# EAGLE design Nodino-Core2538 (EAGLE 6.5.0)
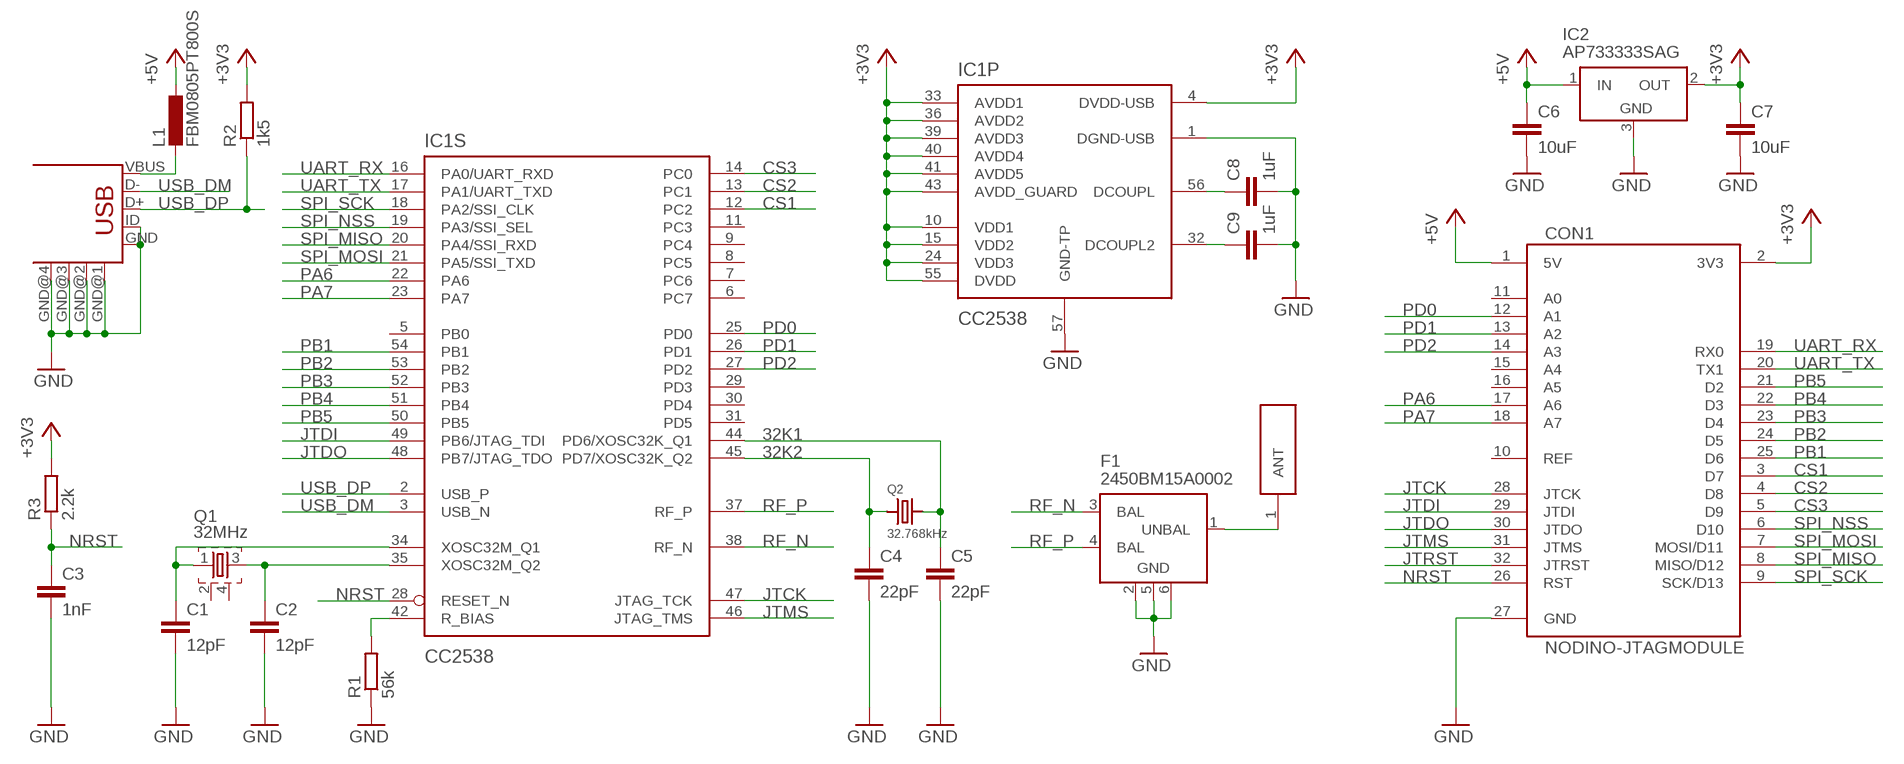
[diagram p0: schematic, sheet 1]

## Parts
ANT1  2450AT18B100  [2450AT18B100]
C1  12pF  C-EUC0603K  [C0603K]
C2  12pF  C-EUC0603K  [C0603K]
C3  1nF  C-EUC0603K  [C0603K]
C4  22pF  C-EUC0603K  [C0603K]
C5  22pF  C-EUC0603K  [C0603K]
C6  10uF  C-EUC0603K  [C0603K]
C7  10uF  C-EUC0603K  [C0603K]
C8  1uF  C-EUC0603K  [C0603K]
C9  1uF  C-EUC0603K  [C0603K]
CON1  NODINO-JTAGMODULE  [NODINO-JTAG-MOD]
CON2  USB-OTG_SHIELD  [USB-UAB-S1]
F1  2450BM15A0002  [2450BM15A0002]
IC1  CC2538  [QFN56P800X800X100-57N]
IC2  AP733333SAG  [SOT23]
L1  FBM0805PT800S  L-EUL0805  [L0805]
Q1  32MHz  FA-20H  [FA-20H]
Q2  32.768kHz  CRYSTAL.ABS07  [ABS07]
R1  56k  R-EU_R0603K  [R0603K]
R2  1k5  R-EU_R0603K  [R0603K]
R3  2.2k  R-EU_R0603K  [R0603K]

## Nets
32K1: C5.1 IC1.44(S:PD6/XOSC32K_Q1) Q2.2
32K2: C4.1 IC1.45(S:PD7/XOSC32K_Q2) Q2.1
+3V3: C7.1 CON1.2(3V3) IC1.4(P:DVDD-USB) IC1.10(P:VDD1) IC1.15(P:VDD2) IC1.24(P:VDD3) IC1.33(P:AVDD1) IC1.36(P:AVDD2) IC1.39(P:AVDD3) IC1.40(P:AVDD4) IC1.41(P:AVDD5) IC1.43(P:AVDD_GUARD) IC1.55(P:DVDD) IC2.2(OUT) R2.2 R3.2
+5V: C6.1 CON1.1(5V) IC2.1(IN) L1.1
CS1: CON1.3(D7) IC1.12(S:PC2)
CS2: CON1.4(D8) IC1.13(S:PC1)
CS3: CON1.5(D9) IC1.14(S:PC0)
GND: C1.2 C2.2 C3.2 C4.2 C5.2 C6.2 C7.2 C8.2 C9.2 CON1.27(GND) CON2.GND CON2.GND@1(GND) CON2.GND@2(GND) CON2.GND@3(GND) CON2.GND@4(GND) CON2.ID F1.2(GND) F1.5(GND) F1.6(GND) IC1.1(P:DGND-USB) IC1.57(P:GND-TP) IC2.3(GND) R1.1
JTCK: CON1.28(JTCK) IC1.47(S:JTAG_TCK)
JTDI: CON1.29(JTDI) IC1.49(S:PB6/JTAG_TDI)
JTDO: CON1.30(JTDO) IC1.48(S:PB7/JTAG_TDO)
JTMS: CON1.31(JTMS) IC1.46(S:JTAG_TMS)
JTRST: CON1.32(JTRST)
N$1: CON2.VBUS L1.2
N$2: ANT1.1(ANT) F1.1(UNBAL)
N$3: C8.1 IC1.56(P:DCOUPL)
N$4: C9.1 IC1.32(P:DCOUPL2)
N$5: IC1.42(S:R_BIAS) R1.2
N$7: C2.1 IC1.35(S:XOSC32M_Q2) Q1.3
N$8: C1.1 IC1.34(S:XOSC32M_Q1) Q1.1
NRST: C3.1 CON1.26(RST) IC1.28(S:RESET_N) R3.1
PA6: CON1.17(A6) IC1.22(S:PA6)
PA7: CON1.18(A7) IC1.23(S:PA7)
PB1: CON1.25(D6) IC1.54(S:PB1)
PB2: CON1.24(D5) IC1.53(S:PB2)
PB3: CON1.23(D4) IC1.52(S:PB3)
PB4: CON1.22(D3) IC1.51(S:PB4)
PB5: CON1.21(D2) IC1.50(S:PB5)
PD0: CON1.12(A1) IC1.25(S:PD0)
PD1: CON1.13(A2) IC1.26(S:PD1)
PD2: CON1.14(A3) IC1.27(S:PD2)
RF_N: F1.3(BAL) IC1.38(S:RF_N)
RF_P: F1.4(BAL) IC1.37(S:RF_P)
SPI_MISO: CON1.8(MISO/D12) IC1.20(S:PA4/SSI_RXD)
SPI_MOSI: CON1.7(MOSI/D11) IC1.21(S:PA5/SSI_TXD)
SPI_NSS: CON1.6(D10) IC1.19(S:PA3/SSI_SEL)
SPI_SCK: CON1.9(SCK/D13) IC1.18(S:PA2/SSI_CLK)
UART_RX: CON1.19(RX0) IC1.16(S:PA0/UART_RXD)
UART_TX: CON1.20(TX1) IC1.17(S:PA1/UART_TXD)
USB_DM: CON2.D- IC1.3(S:USB_N)
USB_DP: CON2.D+ IC1.2(S:USB_P) R2.1
Unconnected: CON1.10(REF) CON1.11(A0) CON1.15(A4) CON1.16(A5) IC1.5(S:PB0) IC1.6(S:PC7) IC1.7(S:PC6) IC1.8(S:PC5) IC1.9(S:PC4) IC1.11(S:PC3) IC1.29(S:PD3) IC1.30(S:PD4) IC1.31(S:PD5) Q1.2 Q1.4

## Library data of the parts
ANT1 = johanson-technology:2450AT18B100
C1-C9 = resistor:C-EU: CAPACITOR, European symbol
CON1 = nodino:NODINO-JTAG
CON2 = con-usb-2:USB-OTG_SHIELD
F1 = johanson-technology:2450BM15A0002: 2.45 GHz Impedance Matched Balun-Filter For TI CC253X/CC2540 Chipset family Data sheet <http://www.johansontechnology.com/images/stories/ip/baluns/balun_filter_combo_matched_2450bm15a0002_v8.pdf>
IC1 = chipcon-ti-v2:CC2538: An ARM Cortex-M3 with 802.15.4 radio
IC2 = diodes_inc:AP7333
L1 = resistor:L-EU: INDUCTOR, European symbol
Q1 = crystal:FA-: MHz RANGE CRYSTAL UNIT Source: Epson Toyocom
Q2 = abracon:CRYSTAL
R1-R3 = resistor:R-EU_: RESISTOR, European symbol

## Board
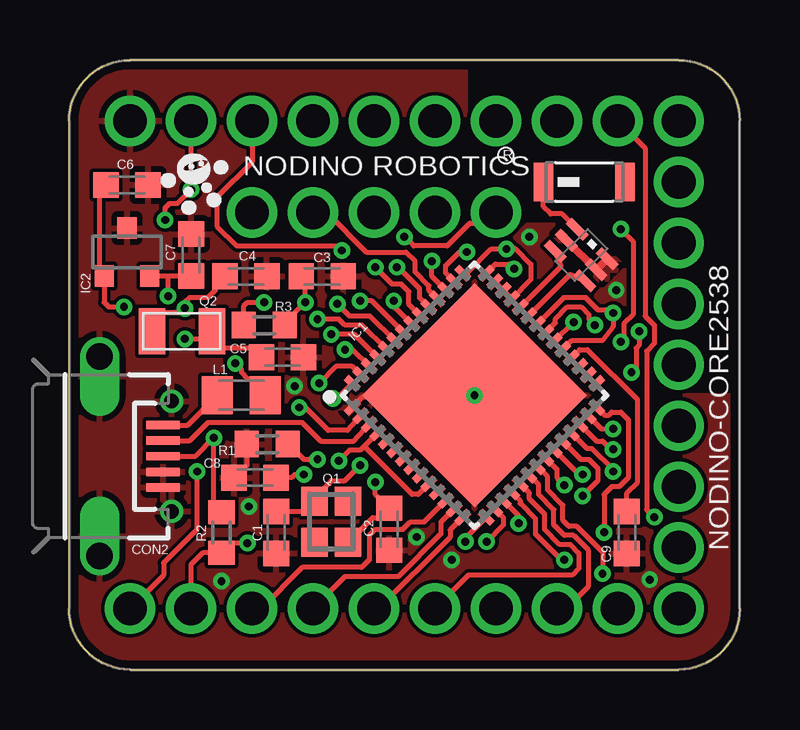
[diagram p1: board, top side]
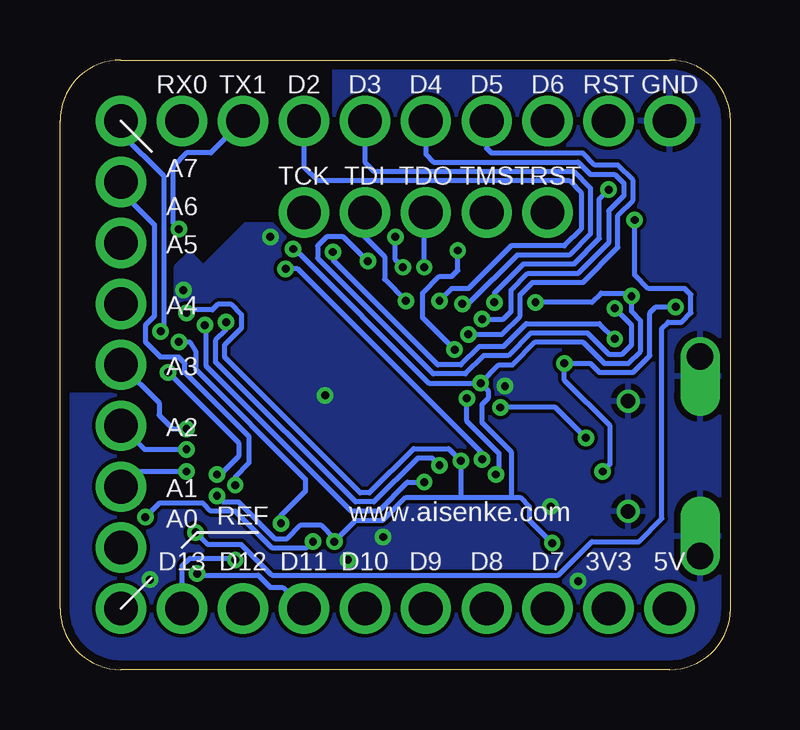
[diagram p2: board, bottom side, seen from below]

Size 27.94 x 25.4 mm. Coordinates in mm from the lower left corner, seen from the top.
Outline: 0,2.54 0,22.86 arc-90 2.54,25.4 25.4,25.4 arc-90 27.94,22.86 27.94,2.54 arc-90 25.4,0 2.54,0 arc-90 0,2.54
Copper layers (1*16): Top 0.0356mm / dielectric 1.5011mm / Bottom 0.0356mm
Design rules "LaenPCBOrder": minimum track width 6mil, minimum drill 13mil, track to track 6mil, track to pad 6mil, pad to pad 6mil, via to via 6mil, smd to smd 6mil, copper to edge 15mil, drill to drill 6mil, minimum pad ring 7mil, minimum via ring 7mil, stop-mask expansion 3mil, vias tented up to drill 0mil, thermal gap 10mil

### Footprints (pad centres in the part's own frame; a part is rotated, then mirrored left to right if it is on the bottom)
2450AT18B100 = smd 0.8 x 1.6: 1 -1.7,0; 2 1.7,0
C0603K = smd 1.05 x 1.08: 1 -0.875,0; 2 0.875,0
NODINO-JTAG-MOD = drill 1.4 pad 2.1: 1 -11.43,-10.16; 2 -8.89,-10.16; 3 -6.35,-10.16; 4 -3.81,-10.16; 5 -1.27,-10.16; 6 1.27,-10.16; 7 3.81,-10.16; 8 6.35,-10.16; 9 8.89,-10.16; 10 11.43,-10.16; 11 11.43,-7.62; 12 11.43,-5.08; 13 11.43,-2.54; 14 11.43,0; 15 11.43,2.54; 16 11.43,5.08; 17 11.43,7.62; 18 11.43,10.16; 19 8.89,10.16; 20 6.35,10.16; 21 3.81,10.16; 22 1.27,10.16; 23 -1.27,10.16; 24 -3.81,10.16; 25 -6.35,10.16; 26 -8.89,10.16; 27 -11.43,10.16; 28 3.81,6.35; 29 1.27,6.35; 30 -1.27,6.35; 31 -3.81,6.35; 32 -6.35,6.35
USB-UAB-S1 = smd 0.35 x 1.4: D+ 0,2.65; D- -0.65,2.65; GND 1.3,2.65; ID 0.65,2.65; VBUS -1.3,2.65 | drill 0.6: GND@1 -2.3,3; GND@2 2.3,3 | drill 1.1 offset: GND@3 -4.15,0; GND@4 4.15,0
2450BM15A0002 = smd 0.35 x 1: 1 -0.65,-0.875; 2 0,-0.875; 3 0.65,-0.875; 4 0.65,0.875; 5 0,0.875; 6 -0.65,0.875
QFN56P800X800X100-57N = smd 0.7 x 0.3: 1 -3.95,3.25; 2 -3.95,2.75; 3 -3.95,2.25; 4 -3.95,1.75; 5 -3.95,1.25; 6 -3.95,0.75; 7 -3.95,0.25; 8 -3.95,-0.25; 9 -3.95,-0.75; 10 -3.95,-1.25; 11 -3.95,-1.75; 12 -3.95,-2.25; 13 -3.95,-2.75; 14 -3.95,-3.25; 29 3.95,-3.25; 30 3.95,-2.75; 31 3.95,-2.25; 32 3.95,-1.75; 33 3.95,-1.25; 34 3.95,-0.75; 35 3.95,-0.25; 36 3.95,0.25; 37 3.95,0.75; 38 3.95,1.25; 39 3.95,1.75; 40 3.95,2.25; 41 3.95,2.75; 42 3.95,3.25 | smd 0.3 x 0.7: 15 -3.25,-3.95; 16 -2.75,-3.95; 17 -2.25,-3.95; 18 -1.75,-3.95; 19 -1.25,-3.95; 20 -0.75,-3.95; 21 -0.25,-3.95; 22 0.25,-3.95; 23 0.75,-3.95; 24 1.25,-3.95; 25 1.75,-3.95; 26 2.25,-3.95; 27 2.75,-3.95; 28 3.25,-3.95; 43 3.25,3.95; 44 2.75,3.95; 45 2.25,3.95; 46 1.75,3.95; 47 1.25,3.95; 48 0.75,3.95; 49 0.25,3.95; 50 -0.25,3.95; 51 -0.75,3.95; 52 -1.25,3.95; 53 -1.75,3.95; 54 -2.25,3.95; 55 -2.75,3.95; 56 -3.25,3.95 | smd 6.6 x 6.6: 57 0,0
SOT23 = smd 0.8 x 0.9: 1 -0.95,-1; 2 0.95,-1; 3 0,1
L0805 = smd 1.3 x 1.6: 1 -1,0; 2 1,0
FA-20H = smd 1.2 x 1.1: 1 -0.85,-0.7; 2 0.85,-0.7; 3 0.85,0.7; 4 -0.85,0.7
ABS07 = smd 1.1 x 1.9: 1 -1.25,0; 2 1.25,0
R0603K = smd 1 x 1.1: 1 -0.85,0; 2 0.85,0

### Placement (x,y rotation side)
ANT1  21.46,20.32 0 top
C1  8.64,5.71 270 top
C2  13.34,5.84 270 top
C3  10.54,16.38 0 top
C4  7.37,16.38 0 top
C5  8.89,13.02 0 top
C6  2.41,20.19 0 top
C7  5.08,17.27 90 top
C8  7.75,8 180 top
C9  23.24,5.71 270 top
CON1  13.97,12.7 0 top
CON2  1.27,8.89 270 top
F1  21.34,17.27 225 top
IC1  16.89,11.43 45 top
IC2  2.41,17.4 0 top
L1  7.18,11.43 180 top
Q1  10.92,6.16 270 top
Q2  4.7,14.1 0 top
R1  8.26,9.4 0 top
R2  6.35,5.71 270 top
R3  8.13,14.35 180 top

### Tracks (layer width: path | path; a pad name or v marks a point on that pad's centre or on a via)
32K1  (via drill 0.33)
  Top 0.203: 6.33,13.86 Q2.2 | 6.08,13.97 Q2.2 | v4.83,13.78 5.63,13.78 Q2.2 | C5.1 7.63,13.4 6.22,13.4 5.95,13.67 Q2.2 | IC1.44 15.68,16.53 15.68,16.83 16.26,17.4 v16.57,17.4
  Bottom 0.203: v16.57,17.4 16.57,17.08 12.19,12.7 11.24,12.7 10.48,13.46 9.46,13.46 8.51,14.41 5.46,14.41 v4.83,13.78
32K2  (via drill 0.33)
  Top 0.203: IC1.45 15.11,16.39 v15.11,17.02 | 3.43,14.12 Q2.1 3.45,14.86 4.64,14.86 v4.83,15.05 4.83,15.3 5.02,15.49 5.78,15.49 6.1,15.81 6.1,16.05 C4.1
  Bottom 0.203: v4.83,15.05 4.13,14.35 4.13,13.53 4.51,13.14 5.08,13.14 5.97,14.03 8.32,14.03 9.27,13.08 10.29,13.08 11.05,12.32 12.38,12.32 17.21,17.14 17.21,17.65 16.83,18.03 16.13,18.03 v15.11,17.02
+3V3  (via drill 0.33)
  Top 0.203: 3.3,16.34 IC2.2 4.13,16.4 | C7.1 4.13,16.4 | IC1.41 IC1.40 IC1.39 19.24,16.26 19.24,16.89 18.61,17.53 v18.22,17.53 17.59,17.53 16.59,16.52 IC1.43 | IC1.33 20.95,13.72 22.23,13.72 22.67,14.29 v22.67,14.86 22.54,14.99 22.04,14.99 21.53,15.49 20.6,15.49 IC1.36 | IC1.15 16.51,5.46 v16.51,5.33 | IC1.10 14.54,7.3 14.29,7.3 12.29,9.3 | 12.29,9.3 12.13,9.14 11.68,9.14 v11.24,8.7 | 12.29,9.3 IC1.4 | CON1.2 5.08,4.38 5.56,4.87 R2.2 6.75,5.27 v7.43,5.27 | v4.13,15.56 4.13,16.4 | IC1.55 11.79,12.64 11.11,12.64 v10.41,11.94 | R3.2 7.28,15.15 7.43,15.3 v8.13,15.3 | IC1.24 21.33,8.76 21.65,8.76 22.04,8.38 22.04,7.87 v21.4,7.24
  Bottom 0.203: 9.14,7.18 9.14,9.08 10.35,10.29 10.35,11.05 10.1,11.3 10.1,11.62 v10.41,11.94 | v7.43,5.27 8.38,6.22 8.38,6.79 8.76,7.18 9.14,7.18 | v8.13,15.3 5.78,15.3 5.4,15.68 4.25,15.68 v4.13,15.56 4.13,14.92 3.75,14.54 3.75,13.27 4.25,12.76 5.27,12.76 6.16,13.65 8.13,13.65 9.08,12.7 9.65,12.7 v10.41,11.94 | v10.41,11.94 12.57,11.94 18.16,17.53 v18.22,17.53 | v22.67,14.86 22.54,14.99 21.59,14.99 21.34,15.24 20.83,15.24 20.38,14.8 20.38,14.22 21.08,13.53 21.08,13.02 15.43,7.37 15.05,7.37 13.21,9.21 11.75,9.21 v11.24,8.7 11.24,7.18 | v21.4,7.24 21.14,6.99 20.51,6.99 18.99,5.46 18.48,5.46 17.91,6.03 17.08,6.03 16.51,5.46 v16.51,5.33 15.62,6.22 14.48,6.22 13.53,7.18 11.24,7.18 | 11.24,7.18 9.14,7.18
+5V  (via drill 0.33)
  Top 0.203: v5.33,8.26 5.33,5.84 3.94,4.45 3.94,3.94 CON1.1 | C6.1 1.27,19.93 1.27,16.59 IC2.1 1.46,15.3 1.65,15.11 v2.29,15.11 | v6.92,12.76 7.18,12.51 7.18,12.38 7.43,12.13 7.94,12.13 8.18,11.89 L1.1
  Bottom 0.203: v5.33,8.26 5.02,8.57 5.02,10.16 6.92,12.06 v6.92,12.76 5.84,12.76 5.46,12.38 4.06,12.38 3.37,13.08 3.37,14.86 3.11,15.11 v2.29,15.11
CS1
  Top 0.203: CON1.3 8,2.54 9.72,4.25 12.19,4.25 12.51,4.57 12.51,5.59 12.76,5.84 13.91,5.84 14.22,6.16 14.8,6.16 IC1.12
CS2
  Top 0.203: IC1.13 15.49,6.14 15.49,5.65 13.72,3.87 11.49,3.87 CON1.4
CS3
  Top 0.203: IC1.14 15.88,5.82 15.88,5.52 12.89,2.54 CON1.5
GND  (via drill 0.33)
  Top 0.203: R1.1 7.41,8.53 C8.2 | IC1.1 12.23,11.37 12.51,11.37 12.57,11.43 IC1.57
  Top 0.305: F1.2 F1.5 F1.6
  other vias: 7.49,6.79 15.94,4.57 24.19,3.75 22.8,15.81 16.89,11.43 19.18,18.03 14.48,5.52 6.35,3.68 9.4,11.81
  pour Top: 0,25.4 16.51,25.4 16.51,20.38 18.73,18.16 19.11,18.54 20.19,18.54 20.7,18.03 19.94,17.27 21.34,15.88 22.73,17.14 23.11,16.76 23.11,11.43 27.94,11.43 27.94,0 0,0
  pour Bottom: 0,25.4 16.51,25.4 16.51,20.38 18.73,18.16 19.11,18.54 20.19,18.54 21.97,16.76 22.54,17.34 23.11,16.76 23.11,11.43 27.94,11.43 27.94,0 0,0
JTCK  (via drill 0.33)
  Top 0.203: CON1.28 17.34,18.61 16.7,18.61 15.75,17.65 14.35,17.65 v13.97,18.03 | IC1.47 14.61,15.48 14.61,15.88 13.72,16.76 v13.65,16.76
  Bottom 0.203: v13.65,16.76 13.97,17.08 v13.97,18.03
JTDI  (via drill 0.33)
  Top 0.203: IC1.49 13.53,15.15 v13.53,15.37
  Bottom 0.203: CON1.29 15.24,18.03 14.41,17.21 14.41,16.26 v13.53,15.37
JTDO  (via drill 0.33)
  Top 0.203: IC1.48 14.16,15.22 14.16,15.75 13.84,16.07 13.46,16.07 v12.76,16.76
  Bottom 0.203: v12.76,16.76 12.76,18.99 CON1.30
JTMS
  Top 0.203: IC1.46 14.99,15.81 14.99,16 14.41,16.57 14.41,17.02 14.03,17.4 12.38,17.4 10.73,19.05 CON1.31
N$1
  Top 0.203: CON2.VBUS 4.94,10.19 L1.2
N$2
  Top 0.203: F1.1 20.54,18.99 20.07,18.99 19.76,19.29 ANT1.1
N$3  (via drill 0.33)
  Top 0.203: v9.78,8.13 9.4,8.13 9.27,8 C8.1 | IC1.56 11.18,11.3 v10.99,11.3
  Bottom 0.203: v9.78,8.13 9.65,8.26 9.65,9.02 10.99,10.35 v10.99,11.3
N$4
  Top 0.203: IC1.32 21.27,13.34 21.59,13.34 23.69,11.24 23.69,7.81 23.24,7.37 C9.1
N$5  (via drill 0.33)
  Top 0.203: IC1.42 17.76,16.89 18.35,16.89 v18.54,16.7 | R1.2 9.14,9.4 9.78,8.76 v10.35,8.76
  Bottom 0.203: v10.35,8.76 10.35,9.02 18.03,16.7 v18.54,16.7
N$7  (via drill 0.33)
  Top 0.203: Q1.3 12.65,6.34 12.95,6.34 C2.1 12.76,7.29 v12.76,7.81 | IC1.35 20.26,14.44 20.26,14.61 20.77,15.11 21.34,15.11 21.65,14.8 21.65,14.61 v21.91,14.35
  Bottom 0.203: v12.76,7.81 13.46,7.81 14.67,6.6 15.81,6.6 21.84,12.64 21.84,14.29 v21.91,14.35
N$8  (via drill 0.33)
  Top 0.203: C1.1 9.8,6.59 Q1.1 | Q1.1 | Q1.1 10.22,7.17 10.92,7.87 11.49,7.87 v12.13,8.51 | IC1.34 21,14.48 v21.02,14.48
  Bottom 0.203: v12.13,8.51 12.45,8.83 13.02,8.83 14.86,6.99 15.62,6.99 21.46,12.83 21.46,13.72 21.02,14.16 v21.02,14.48
NRST  (via drill 0.33)
  Top 0.203: CON1.26 v5.08,20 4.51,19.43 4.19,19.43 4,19.24 v4,18.73 | R3.1 8.98,14.44 v9.84,15.3 9.84,16.21 C3.1 | IC1.28 22.31,10.6 22.48,10.6 22.61,10.73 22.99,10.73 23.3,10.41 23.3,8 22.92,7.62 22.61,7.62 22.29,7.3 v22.29,5.71
  Bottom 0.203: v22.29,5.71 21.78,5.21 20.38,5.21 19.11,3.94 7.18,3.94 5.78,5.33 3.81,5.33 2.86,6.29 2.86,14.22 2.6,14.48 2.03,14.48 1.65,14.86 1.65,15.62 1.91,15.88 3.43,15.88 4,16.45 v4,18.73 | v5.08,20 5.46,19.62 5.46,17.97 6.54,16.89 8.64,16.89 9.84,15.68 v9.84,15.3
PA6  (via drill 0.33)
  Top 0.203: IC1.22 20.32,8.36 20.32,8 v20.64,7.68
  Bottom 0.203: CON1.17 25.4,19.94 24,18.54 24,14.73 24.38,14.35 24.38,13.65 23.75,13.02 22.99,13.02 22.73,12.76 22.73,12.38 20.07,9.72 20.07,8.61 20.64,8.04 v20.64,7.68
PA7  (via drill 0.33)
  Top 0.203: IC1.23 21.25,8.13 v21.4,8.13 | v23.75,14.1 23.75,13.53 23.62,13.4 23.62,12.57 v23.43,12.38
  Bottom 0.203: CON1.18 25.4,22.35 23.62,20.57 23.62,14.22 v23.75,14.1 | v23.43,12.38 20.5,9.45 20.5,8.88 21.25,8.13 v21.4,8.13
PB1  (via drill 0.33)
  Top 0.203: IC1.54 11.8,13.34 v11.49,13.34 | CON1.25 7.62,21.14 6.16,19.68 6.16,18.48 6.99,17.65 11.18,17.65 v11.37,17.46
  Bottom 0.203: v11.49,13.34 12.83,14.67 12.83,15.68 12.13,16.38 11.62,16.38 11.37,16.64 v11.37,17.46
PB2  (via drill 0.33)
  Top 0.203: IC1.53 11.88,13.97 v10.92,13.97
  Bottom 0.203: v10.92,13.97 9.53,13.97 8.76,14.73 8.76,15.62 8.26,16.13 6.16,16.13 4.7,17.59 4.7,18.92 4.06,19.56 4.06,20.38 4.7,21.02 5.65,21.02 6.16,21.53 9.97,21.53 10.16,21.72 CON1.24
PB3  (via drill 0.33)
  Top 0.203: IC1.52 12.2,14.35 11.49,14.35 11.24,14.61 v10.35,14.61
  Bottom 0.203: CON1.23 12.7,21.46 12.38,21.14 6.35,21.14 5.84,20.64 4.83,20.64 4.45,20.26 4.45,19.75 5.08,19.11 5.08,17.78 6.35,16.51 8.45,16.51 9.14,15.81 9.14,14.92 9.46,14.61 v10.35,14.61
PB4  (via drill 0.33)
  Top 0.203: IC1.51 12.53,14.73 11.68,14.73 v11.18,15.24
  Bottom 0.203: CON1.22 15.24,21.14 14.86,20.77 6.54,20.77 5.84,20.07 5.84,18.16 6.73,17.27 8.89,17.27 10.92,15.24 v11.18,15.24
PB5  (via drill 0.33)
  Top 0.203: IC1.50 12.6,15.37 v12.13,15.37
  Bottom 0.203: CON1.21 17.78,20.95 17.21,20.38 6.73,20.38 6.22,19.88 6.22,18.35 6.92,17.65 9.14,17.65 10.92,15.88 11.62,15.88 v12.13,15.37
PD0  (via drill 0.33)
  Top 0.203: v22.67,8.26 22.67,8.32 21.78,9.21 21.59,9.21 IC1.25
  Bottom 0.203: CON1.12 24.77,8.26 v22.67,8.26
PD1  (via drill 0.33)
  Top 0.203: IC1.26 21.98,9.53 22.23,9.53 22.57,9.18 v22.67,9.18
  Bottom 0.203: CON1.13 24.42,9.18 v22.67,9.18
PD2  (via drill 0.33)
  Top 0.203: IC1.27 22.18,10.03 v22.67,10.03
  Bottom 0.203: CON1.14 23.81,11.11 23.81,10.6 23.24,10.03 v22.67,10.03
RF_N
  Top 0.203: IC1.38 20.5,16.81 F1.3
RF_P
  Top 0.203: IC1.37 20.87,16.47 F1.4
SPI_MISO
  Top 0.203: IC1.20 19.56,7.7 19.56,7.3 20.19,6.67 20.19,6.03 20.64,5.59 21.02,5.59 21.62,4.99 21.62,3.46 20.89,2.73 20.51,2.73 CON1.8
SPI_MOSI  (via drill 0.33)
  Top 0.203: IC1.21 19.94,8.03 19.94,7.49 20.57,6.86 20.57,6.22 20.83,5.97 21.14,5.97 22.23,4.89 v22.23,4
  Bottom 0.203: v22.23,4 22.16,3.94 19.68,3.94 19.18,3.43 18.67,3.43 CON1.7
SPI_NSS
  Top 0.203: CON1.6 16.64,3.94 20.95,3.94 21.24,4.22 21.24,4.86 20.89,5.21 20.45,5.21 19.81,5.84 19.81,6.48 19.18,7.11 19.18,7.37 IC1.19
SPI_SCK  (via drill 0.33)
  Top 0.203: IC1.18 18.8,7.05 18.8,6.92 19.43,6.29 19.43,5.65 20.51,4.57 v20.64,4.57
  Bottom 0.203: CON1.9 22.86,4.32 22.54,4.64 20.7,4.64 v20.64,4.57
UART_RX  (via drill 0.33)
  Top 0.203: CON1.19 24,21.72 24,14.73 24.38,14.35 24.38,13.59 24.07,13.27 24.07,6.67 v24.38,6.35 | IC1.16 18.1,6.33 18.1,6.03 v17.4,5.33
  Bottom 0.203: v17.4,5.33 17.65,5.08 19.11,5.08 20.64,6.6 21.65,6.6 21.97,6.92 23.81,6.92 v24.38,6.35
UART_TX  (via drill 0.33)
  Top 0.203: IC1.17 18.73,6.41 v18.73,6.1 | v22.99,18.35 23.5,17.84 23.5,14.8 23.11,14.41 23.11,13.78 v22.99,13.65
  Bottom 0.203: CON1.20 21.65,21.53 22.67,21.53 23.24,20.95 23.24,18.61 v22.99,18.35 | v22.99,13.65 22.54,13.65 22.29,13.27 22.29,12.51 17.72,7.94 17.72,7.43 18.73,6.41 v18.73,6.1
USB_DM
  Top 0.203: IC1.3 11.87,9.53 10.48,9.53 9.72,10.29 5.78,10.29 5.03,9.54 CON2.D-
USB_DP  (via drill 0.33)
  Top 0.203: IC1.2 11.61,9.97 10.79,9.97 9.84,10.92 v9.59,10.92 | R2.1 6.03,6.88 v6.03,9.65 5.27,8.89 CON2.D+
  Bottom 0.203: v6.03,9.65 7.3,10.92 v9.59,10.92

### Text on the board
tPlace: NODINO ROBOTICS | R | NODINO-CORE2538
bPlace: www.aisenke.com
Document: I2C | I2C | UART | UART | SCL | SDA | TX | RX | GND | RST | D6 | D5 | D4 | D3 | D2 | D1 | D0 | A7 | D21 | A6 | D20 | D17 | D16 | D15 | D7 | D8 | D9 | D10 | D11 | D12 | D13 | 5V | 3V3 | SPI | SPI | SPI | SPI | SPI | SPI | SPI | CS1 | CS2 | CS3 | NSS | MOSI | MISO | SCK